# EAGLE design main_pa6 (EAGLE 4.11)
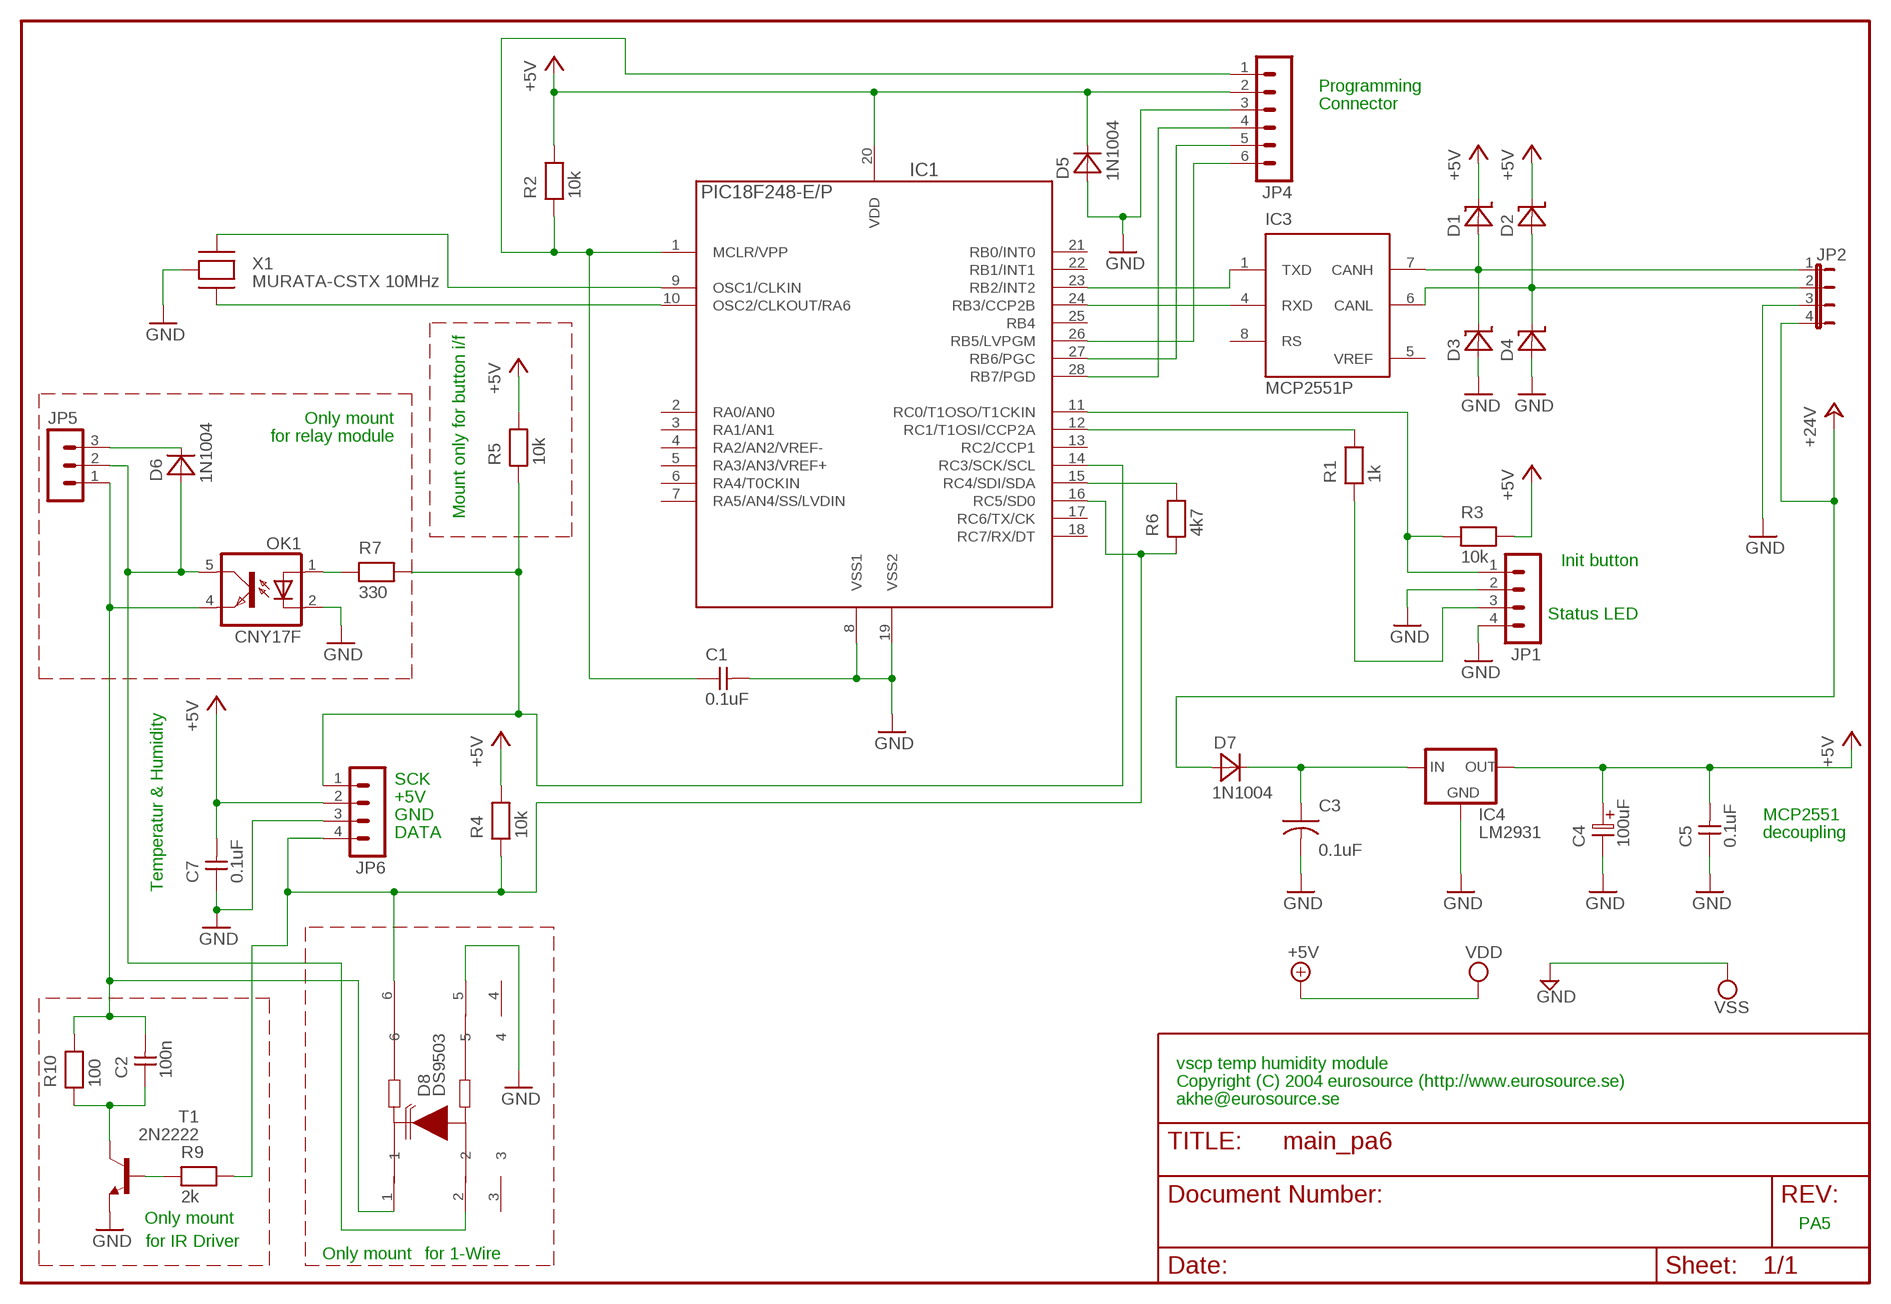
[diagram p0: schematic, sheet 1]

## Parts
C1  0.1uF  CAPNP-2,5  [C-2,5]
C2  100n  CAPNP-2,5  [C-2,5]
C3  0.1uF  CAP-5  [C-5]
C4  100uF  ELC-5  [ES-5]
C5  0.1uF  CAPNP-2,5  [C-2,5]
C7  0.1uF  CAPNP-2,5  [C-2,5]
D1  ZDIO-2,5  [D-2,5]
D2  ZDIO-2,5  [D-2,5]
D3  ZDIO-2,5  [D-2,5]
D4  ZDIO-2,5  [D-2,5]
D5  1N1004  DIODE-7,5  [D-7,5]
D6  1N1004  DIODE-7,5  [D-7,5]
D7  1N1004  DIODE-7,5  [D-7,5]
D8  DS9503  [TSOC6]
IC1  PIC18F248-E/P  PIC18F252-E/P  [PDIP-28]
IC3  MCP2551P  [DIL8]
IC4  LM2931  78LXX  [78LXX]
JP1  MA04-1  [MA04-1]
JP2  JP4E  [JP4]
JP4  MA06-1  [MA06-1]
JP5  MA03-1  [MA03-1]
JP6  MA04-1  [MA04-1]
OK1  CNY17F  [DIL06]
R1  1k  RESEU-5  [R-5]
R2  10k  RESEU-5  [R-5]
R3  10k  RESEU-5  [R-5]
R4  10k  RESEU-5  [R-5]
R5  10k  RESEU-5  [R-5]
R6  4k7  RESEU-5  [R-5]
R7  330  RESEU-5  [R-5]
R9  2k  RESEU-5  [R-5]
R10  100  RESEU-5  [R-5]
T1  2N2222  [TO18]
X1  MURATA-CSTX 10MHz  MURATA-CSTX  [RESONATOR-MURATA]

## Nets
+5V: D5.2(K) IC1.20(VDD) JP4.2 R2.2
+24V: D7.1(A) JP2.4
CANH: D1.1(A) D3.2(K) IC3.7(CANH) JP2.1
CANL: D2.1(A) D4.2(K) IC3.6(CANL) JP2.2
GND: C1.2 C3.2 C4.2 C5.1 C7.1 D3.1(A) D4.1(A) D5.1(A) D8.5 IC1.8(VSS1) IC1.9(OSC1/CLKIN) IC1.19(VSS2) IC4.GND JP1.2 JP1.4 JP2.3 JP4.3 JP6.3 OK1.2(C) T1.1(E) X1.1(XTIN) X1.2(GND) ; supply symbol labelled VSS
MCLR: C1.1 IC1.1(MCLR/VPP) JP4.1 R2.1
N$1: IC1.10(OSC2/CLKOUT/RA6) X1.3(XTOUT)
N$2: IC1.12(RC1/T1OSI/CCP2A) R1.2
N$5: JP1.3 R1.1
N$6: IC1.11(RC0/T1OSO/T1CKIN) JP1.1 R3.1
N$8: OK1.1(A) R7.1
N$9: D6.2(K) JP5.3
N$12: R9.1 T1.2(B)
N$13: C2.1 R10.1 T1.3(C)
N$22: C3.1 D7.2(K) IC4.IN
OWDATA: C2.2 D8.1 JP5.1 OK1.4(EMIT) R10.2
OWGND: D6.1(A) D8.2 JP5.2 OK1.5(COL)
PGC: IC1.27(RB6/PGC) JP4.5
PGD: IC1.28(RB7/PGD) JP4.4
PGM: IC1.26(RB5/LVPGM) JP4.6
RXCAN: IC1.24(RB3/CCP2B) IC3.4(RXD)
SCK: IC1.14(RC3/SCK/SCL) JP6.1 R5.1 R7.2
SDA: IC1.15(RC4/SDI/SDA) R6.2
SDO: D8.6 IC1.16(RC5/SD0) JP6.4 R4.1 R6.1 R9.2
TXCAN: IC1.23(RB2/INT2) IC3.1(TXD)
VDD: C4.1 C5.2 C7.2 D1.2(K) D2.2(K) IC4.OUT JP6.2 R3.2 R4.2 R5.2 ; supply symbol labelled +5V
Unconnected: D8.3 D8.4 IC1.2(RA0/AN0) IC1.3(RA1/AN1) IC1.4(RA2/AN2/VREF-) IC1.5(RA3/AN3/VREF+) IC1.6(RA4/T0CKIN) IC1.7(RA5/AN4/SS/LVDIN) IC1.13(RC2/CCP1) IC1.17(RC6/TX/CK) IC1.18(RC7/RX/DT) IC1.21(RB0/INT0) IC1.22(RB1/INT1) IC1.25(RB4) IC3.8(RS)

## Notes on the sheet
- Programming
- Connector
- Only mount
- for relay module
- Mount only for button i/f
- Init button
- Status LED
- SCK
- +5V
- GND | MCP2551
- DATA | decoupling
- Temperatur & Humidity
- vscp temp humidity module
- Copyright (C) 2004 eurosource (http://www.eurosource.se)
- akhe@eurosource.se
- Only mount
- PA5
- for IR Driver | Only mount | for 1-Wire

## Power pins joined to a net without a drawn wire
GND: IC3.2(VSS)
VDD: IC3.3(VDD)
VREF: IC3.5(VREF)

## Library data of the parts
C1 C2 C5 C7 = discrete:CAPNP-2,5
C3 = discrete:CAP-5
C4 = discrete:ELC-5
D1-D4 = discrete:ZDIO-2,5
D5-D7 = discrete:DIODE-7,5
D8 = eurosource_dallas:DS9503
IC1 = pic18:PIC18*F252-?: 18F252, 28 pin, 32Kb prog, 1536 data, 256 EEPROM
IC3 = microchip_can:MCP2551: High Speed CAN tranceiver
IC4 = v-reg:78LXX: VOLTAGE REGULATOR
JP1 JP6 = con-lstb:MA04-1
JP2 = jumper:JP4E: JUMPER
JP4 = con-lstb:MA06-1
JP5 = con-lstb:MA03-1
OK1 = optocoupler:CNY17F: SIEMENS OPTO COUPLER
R1-R7 R9 R10 = discrete:RESEU-5
T1 = transistor:2N2222: NPN TRANSISTOR
X1 = eurosource_ftdi:MURATA-CSTX

## Board
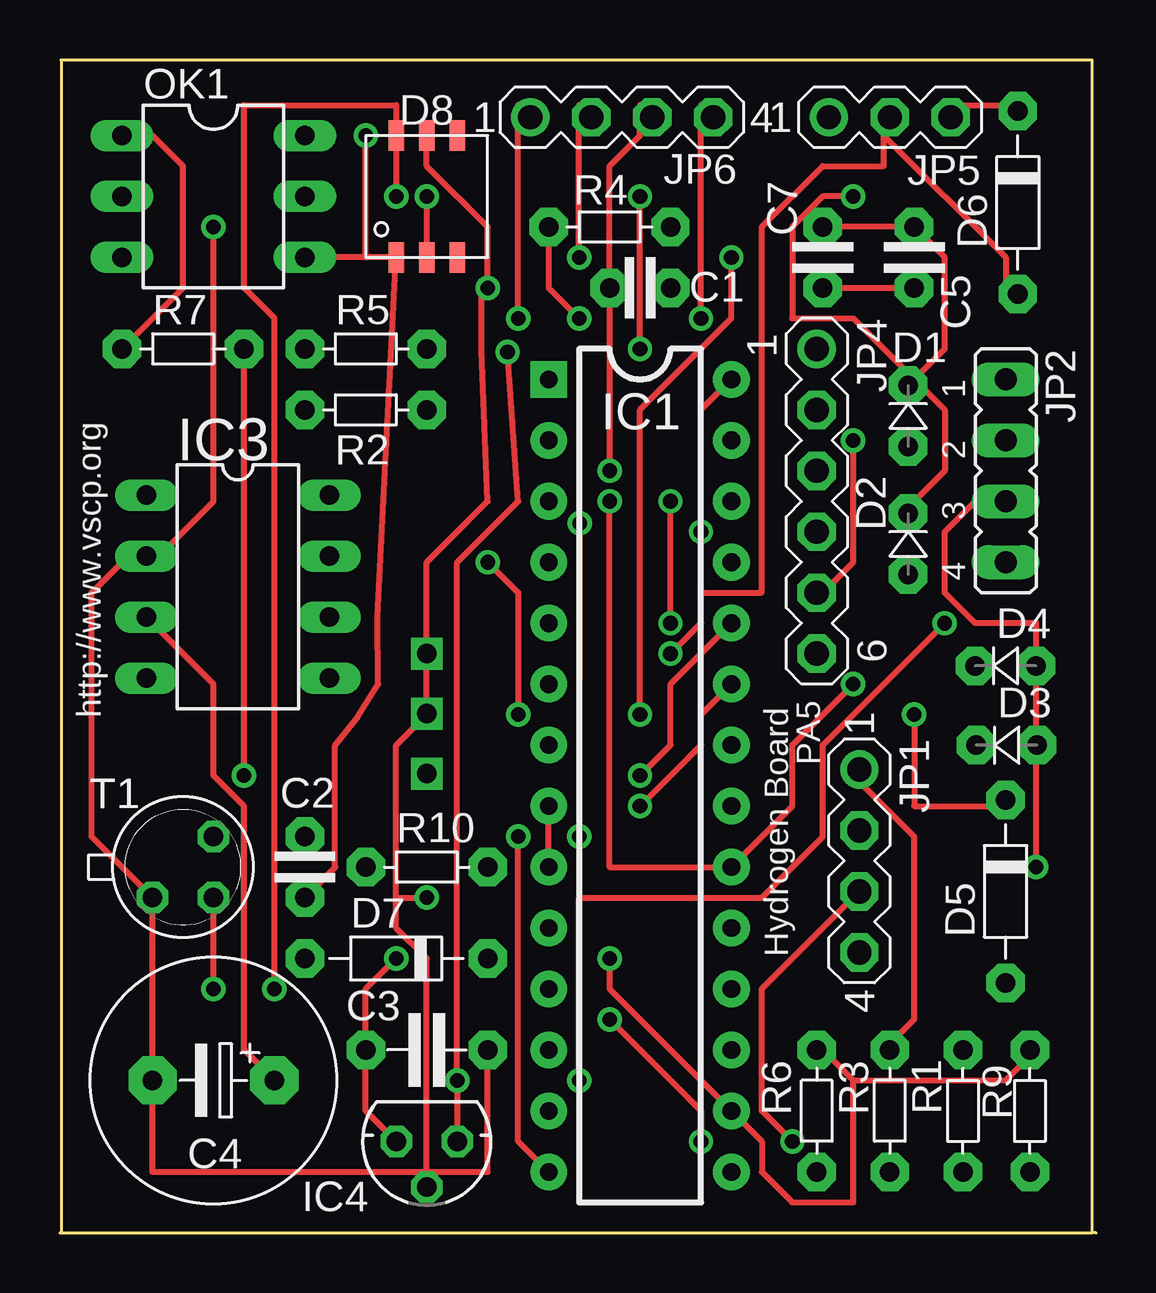
[diagram p1: board, top side]
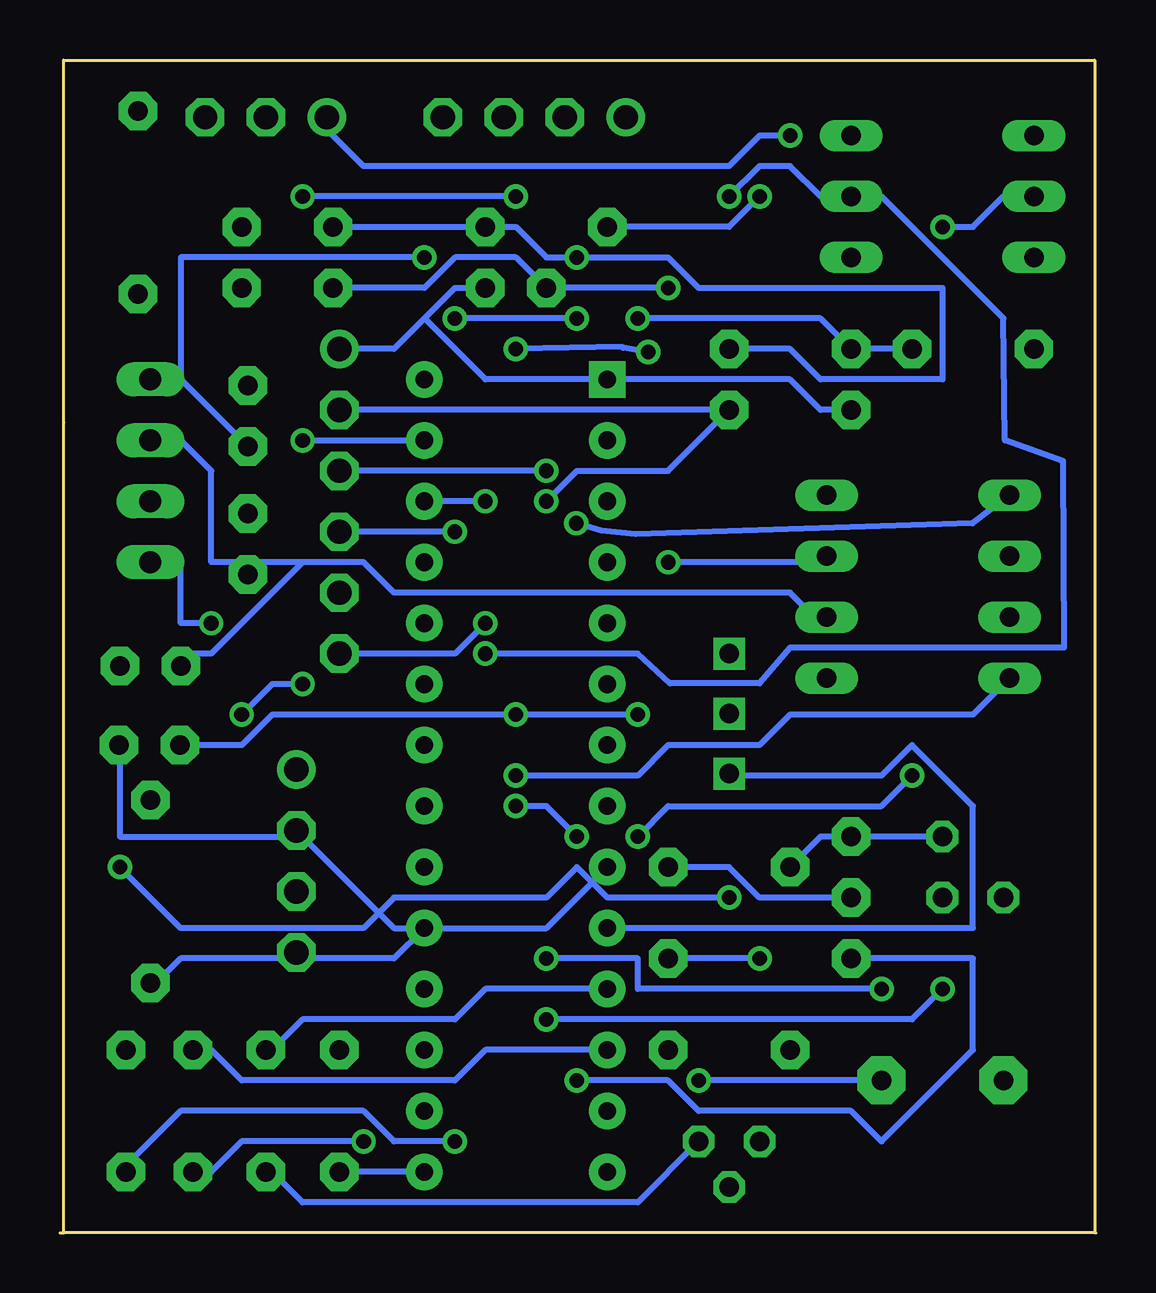
[diagram p2: board, bottom side, seen from below]

Size 43.18 x 48.87 mm. Coordinates in mm from the lower left corner, seen from the top.
Copper layers (1*16): Top 0.0254mm / dielectric 1.4986mm / Bottom 0.0254mm
Design rules "10mils": minimum track width 10mil, minimum drill 24mil, track to track 10mil, track to pad 10mil, pad to pad 10mil, via to via 10mil, smd to smd 10mil, copper to edge 40mil, drill to drill 10mil, minimum pad ring 10mil, minimum via ring 8mil, stop-mask expansion 0mil, vias tented up to drill 0mil, thermal gap 10mil

### Footprints (pad centres in the part's own frame; a part is rotated, then mirrored left to right if it is on the bottom)
C-2,5 = drill 0.813 pad 1.6 octagon: 1 -1.27,0; 2 1.27,0
C-5 = drill 0.813 pad 1.6 octagon: 1 -2.54,0; 2 2.54,0
ES-5 = drill 0.813 pad 2.007 octagon: 1 -2.54,0; 2 2.54,0
D-2,5 = drill 0.813 pad 1.6 octagon: 1 -1.27,0; 2 1.27,0
D-7,5 = drill 0.813 pad 1.6 octagon: 1 -3.81,0; 2 3.81,0
TSOC6 = smd 1.27 x 0.635: 1 -2.54,1.27; 2 -2.54,0; 3 -2.54,-1.27; 4 2.54,-1.27; 5 2.54,0; 6 2.54,1.27
PDIP-28 = drill 0.737 pad 1.524 square: 1 -17.78,-3.81 | drill 0.737 pad 1.524 round: 2 -15.24,-3.81; 3 -12.7,-3.81; 4 -10.16,-3.81; 5 -7.62,-3.81; 6 -5.08,-3.81; 7 -2.54,-3.81; 8 0,-3.81; 9 2.54,-3.81; 10 5.08,-3.81; 11 7.62,-3.81; 12 10.16,-3.81; 13 12.7,-3.81; 14 15.24,-3.81; 15 15.24,3.81; 16 12.7,3.81; 17 10.16,3.81; 18 7.62,3.81; 19 5.08,3.81; 20 2.54,3.81; 21 0,3.81; 22 -2.54,3.81; 23 -5.08,3.81; 24 -7.62,3.81; 25 -10.16,3.81; 26 -12.7,3.81; 27 -15.24,3.81; 28 -17.78,3.81
DIL8 = drill 0.813 long: 1 -3.81,-3.81; 2 -1.27,-3.81; 3 1.27,-3.81; 4 3.81,-3.81; 5 3.81,3.81; 6 1.27,3.81; 7 -1.27,3.81; 8 -3.81,3.81
78LXX = drill 0.813 octagon: GND 0,1.905; IN 1.27,0; OUT -1.27,0
MA04-1 = drill 1.016 pad 1.6 round: 1 -3.81,0 | drill 1.016 pad 1.6 octagon: 2 -1.27,0; 3 1.27,0; 4 3.81,0
JP4 = drill 0.914 long: 1 -3.81,0; 2 -1.27,0; 3 1.27,0; 4 3.81,0
MA06-1 = drill 1.016 pad 1.6 round: 1 -6.35,0 | drill 1.016 pad 1.6 octagon: 2 -3.81,0; 3 -1.27,0; 4 1.27,0; 5 3.81,0; 6 6.35,0
MA03-1 = drill 1.016 pad 1.6 round: 1 -2.54,0 | drill 1.016 pad 1.6 octagon: 2 0,0; 3 2.54,0
DIL06 = drill 0.813 long: 1 -2.54,-3.81; 2 0,-3.81; 3 2.54,-3.81; 4 2.54,3.81; 5 0,3.81; 6 -2.54,3.81
R-5 = drill 0.813 pad 1.6 octagon: 1 -2.54,0; 2 2.54,0
TO18 = drill 0.813 octagon: 1 -1.27,-1.27; 2 1.27,-1.27; 3 1.27,1.27
RESONATOR-MURATA = drill 0.813 square: 1 0,0; 2 2.5,0; 3 5,0

### Placement (x,y rotation side)
C1  24.18,39.37 180 top
C2  10.21,15.24 270 top
C3  15.29,7.62 0 top
C4  6.4,6.35 180 top
C5  35.61,40.64 90 top
C7  31.8,40.64 90 top
D1  35.35,34.04 90 top
D2  35.35,28.7 90 top
D3  39.46,20.32 180 top
D4  39.42,23.62 180 top
D5  39.42,14.22 90 top
D6  39.93,42.93 90 top
D7  14.02,11.43 0 top
D8  15.29,43.18 90 top
IC1  24.18,17.78 270 top
IC3  7.42,26.92 270 top
IC4  15.29,3.81 180 top
JP1  33.32,15.49 270 top
JP2  39.42,31.75 270 top
JP4  31.54,30.48 270 top
JP5  34.59,46.48 0 top
JP6  23.42,46.48 0 top
OK1  6.4,43.18 270 top
R1  37.64,5.08 90 top
R2  12.75,34.29 0 top
R3  34.59,5.08 270 top
R4  22.91,41.91 0 top
R5  12.75,36.83 0 top
R6  31.54,5.08 270 top
R7  5.13,36.83 0 top
R9  40.44,5.08 90 top
R10  15.29,15.24 0 top
T1  5.13,15.24 0 top
U$2  [DIN_SIMPLE]  0.05,0 0 top
X1  15.29,24.13 270 top

### Tracks (layer width: path | path; a pad name or v marks a point on that pad's centre or on a via)
+5V  (via drill 0.61)
  Top 0.254: v22.91,30.48 22.91,15.24 IC1.20 30.53,17.78 30.53,20.32 v33.07,22.86 | v35.61,21.59 35.61,17.78 39.42,17.78 D5.2
  Bottom 0.254: v22.91,30.48 21.64,31.75 17.83,31.75 R2.2 JP4.2 31.8,34.29 | v35.61,21.59 34.34,22.86 v33.07,22.86
+24V  (via drill 0.61)
  Top 0.254: v36.88,25.4 31.8,20.32 31.8,16.51 29.26,13.97 21.64,13.97 v21.64,6.35
  Bottom 0.254: v36.88,25.4 38.15,25.4 38.15,27.94 JP2.4 | v21.64,6.35 17.83,6.35 16.56,5.08 10.21,5.08 8.94,3.81 5.13,7.62 5.13,11.43 D7.1
CANH  (via drill 0.61)
  Top 0.254: v17.83,27.94 19.1,26.67 v19.1,21.59 | v27.99,40.64 27.99,38.1 24.18,34.29 v24.18,21.59
  Bottom 0.254: 38.15,35.56 D1.1 | v17.83,27.94 11.48,27.94 IC3.7 | v19.1,21.59 v24.18,21.59 34.34,21.59 35.61,20.32 D3.2 | 38.15,35.56 38.15,40.64 v27.99,40.64 | 38.15,35.56 JP2.1
CANL
  Bottom 0.254: 33.07,27.94 35.61,27.94 | 33.07,27.94 30.53,27.94 29.26,26.67 12.75,26.67 11.48,25.4 IC3.6 | 35.61,27.94 36.88,27.94 36.88,31.75 38.15,33.02 JP2.2 | 35.61,27.94 D2.1 | 33.07,27.94 36.88,24.13 38.15,24.13 D4.2
GND  (via drill 0.61)
  Top 0.254: 40.69,24.13 40.69,25.4 38.15,25.4 36.88,26.67 36.88,29.21 38.15,30.48 JP2.3 | 40.69,20.32 40.69,24.13 | 40.69,24.13 D4.1 | IC1.9 IC1.8 | C7.1 C5.1 | JP6.3 24.18,46.99 24.18,45.72 22.91,44.45 C1.2 v22.91,31.75 | D8.5 15.29,44.45 17.83,41.91 v17.83,39.37 17.57,39.37 17.57,36.76 17.83,30.48 15.29,27.94 X1.1 X1.2 15.29,21.59 14.02,20.32 14.02,13.97 | 15.29,2.54 17.83,2.54 C3.2 | v6.4,41.91 6.4,30.48 3.86,27.94 IC3.2 2.59,27.94 1.32,26.67 1.32,16.51 T1.1 C4.2 3.86,2.54 15.29,2.54 | 14.02,13.97 14.02,12.7 15.29,11.43 15.29,2.54 | 15.29,2.54 IC4.GND | v40.69,15.24 40.69,20.32 | 14.02,13.97 v15.29,13.97 | 40.69,20.32 D3.1
  Bottom 0.254: IC1.19 29.26,11.43 33.07,11.43 | 33.07,11.43 38.15,11.43 39.42,10.16 D5.1 | 33.07,11.43 JP1.4 | 33.07,16.51 29.26,12.7 IC1.19 | IC1.9 22.91,12.7 IC1.19 | 33.07,16.51 40.69,16.51 40.69,20.32 D3.1 | 33.07,16.51 JP1.2 | v22.91,31.75 JP4.3 31.8,31.75 | C7.1 27.99,39.37 26.72,40.64 24.18,40.64 C1.2 v17.83,39.37 | v6.4,41.91 5.13,41.91 3.86,43.18 OK1.2 | v40.69,15.24 38.15,12.7 30.53,12.7 29.26,13.97 22.91,13.97 21.64,15.24 20.37,13.97 v15.29,13.97
MCLR
  Bottom 0.254: C1.1 26.72,39.37 27.99,38.1 | 27.99,38.1 29.26,36.83 JP4.1 31.8,36.83 | R2.1 11.48,34.29 12.75,35.56 IC1.1 25.45,35.56 27.99,38.1
N$1
  Bottom 0.254: IC1.10 5.13,12.7 5.13,17.78 7.67,20.32 8.94,19.05 15.29,19.05 X1.3
N$2
  Bottom 0.254: IC1.12 25.45,7.62 26.72,6.35 35.61,6.35 36.88,7.62 R1.2
N$5  (via drill 0.61)
  Top 0.254: v30.53,3.81 29.26,5.08 29.26,10.16 JP1.3
  Bottom 0.254: v30.53,3.81 35.61,3.81 36.88,2.54 R1.1
N$6
  Top 0.254: JP1.1 33.07,19.05 35.61,16.51 35.61,8.89 34.34,7.62 R3.1
  Bottom 0.254: IC1.11 25.45,10.16 26.72,8.89 33.07,8.89 34.34,7.62 R3.1
N$8
  Top 0.254: R7.1 5.13,39.37 5.13,44.45 3.86,45.72 OK1.1
N$9
  Top 0.254: JP5.3 36.88,46.99 39.42,46.99 D6.2
N$12  (via drill 0.61)
  Top 0.254: v6.4,10.16 T1.2 | v22.91,8.89 26.72,5.08 v26.72,3.81
  Bottom 0.254: v6.4,10.16 7.67,8.89 v22.91,8.89 | v26.72,3.81 29.26,3.81 30.53,5.08 38.15,5.08 40.69,2.54 R9.1
N$13
  Bottom 0.254: T1.3 C2.1 11.48,16.51 R10.1
N$22  (via drill 0.61)
  Top 0.254: IC4.IN 12.75,5.08 C3.1 12.75,10.16 v14.02,11.43
  Bottom 0.254: v14.02,11.43 D7.2
OWDATA  (via drill 0.61)
  Top 0.254: 12.75,40.64 D8.1 13.23,25.69 13.27,22.86 12.39,21.46 11.48,20.32 11.48,15.24 C2.2 | 12.75,40.64 OK1.4 | 12.75,40.64 v12.75,45.72
  Bottom 0.254: C2.2 14.02,13.97 15.29,15.24 R10.2 | v12.75,45.72 14.02,45.72 15.29,44.45 30.53,44.45 31.8,45.72 JP5.1
OWGND  (via drill 0.61)
  Top 0.254: v15.29,43.18 D8.2 | 34.34,45.72 39.42,40.64 39.42,39.37 D6.1 | v25.45,24.13 26.72,25.4 26.72,26.67 29.26,26.67 29.26,41.91 31.8,44.45 34.34,44.45 34.34,45.72 | 34.34,45.72 JP5.2
  Bottom 0.254: v15.29,43.18 14.02,44.45 12.75,44.45 11.48,43.18 OK1.5 8.94,43.18 3.86,38.1 3.79,33.01 1.36,32.15 1.32,24.39 12.75,24.39 14.02,22.9 17.75,22.9 19.1,24.13 v25.45,24.13
PGC  (via drill 0.61)
  Top 0.254: v33.07,33.02 33.07,27.94 31.8,26.67 JP4.5
  Bottom 0.254: v33.07,33.02 IC1.27
PGD  (via drill 0.61)
  Top 0.254: IC1.28 26.72,34.29 v26.72,29.21
  Bottom 0.254: v26.72,29.21 JP4.4 31.8,29.21
PGM  (via drill 0.61)
  Top 0.254: v25.45,25.4 v25.45,30.48
  Bottom 0.254: v25.45,30.48 IC1.26 | v25.45,25.4 26.72,24.13 JP4.6 31.8,24.13
RXCAN  (via drill 0.61)
  Top 0.254: v24.18,19.05 25.45,20.32 25.45,22.86 IC1.24
  Bottom 0.254: v24.18,19.05 19.1,19.05 17.83,20.32 14.02,20.32 12.75,21.59 5.13,21.59 IC3.4
SCK  (via drill 0.61)
  Top 0.254: IC1.14 19.1,3.81 v19.1,16.51 | v7.67,19.05 R7.2 | v19.1,38.1 19.1,46.99 JP6.1
  Bottom 0.254: v19.1,16.51 17.83,17.78 8.94,17.78 v7.67,19.05 | R7.2 R5.1 11.48,38.1 v19.1,38.1
SDA
  Bottom 0.254: IC1.15 R6.2 31.8,2.54
SDO  (via drill 0.61)
  Top 0.254: 33.07,6.35 33.07,1.27 30.53,1.27 29.26,2.54 29.26,3.81 IC1.16 22.91,10.16 v22.91,11.43 | 33.07,6.35 31.8,7.62 R6.1 | 33.07,6.35 39.42,6.35 40.69,7.62 R9.2 | v14.02,43.18 D8.6 14.02,46.99 7.67,46.99 7.67,39.37 8.94,38.1 v8.94,10.16 | v26.72,38.1 26.72,46.99 JP6.4 | v21.64,38.1 20.37,39.37 R4.1
  Bottom 0.254: v14.02,43.18 15.29,41.91 R4.1 | v21.64,38.1 v26.72,38.1 | v22.91,11.43 19.1,11.43 19.1,10.16 v8.94,10.16
TXCAN  (via drill 0.61)
  Top 0.254: v21.66,29.57 v21.64,16.51 | v24.18,17.78 26.72,20.32 26.72,21.59 IC1.23
  Bottom 0.254: v21.66,29.57 20.61,29.25 19.19,29.11 5.15,29.57 IC3.1 | v21.64,16.51 22.91,17.78 v24.18,17.78
VDD  (via drill 0.61)
  Top 0.254: 35.61,35.56 36.88,34.29 36.88,31.75 35.61,30.48 D2.2 | C7.2 C5.2 36.88,40.64 36.88,36.83 35.61,35.56 | v21.64,40.64 21.64,46.99 JP6.2 | C4.1 7.67,7.62 7.67,17.78 6.4,19.05 6.4,22.86 IC3.3 | IC4.OUT v16.56,6.35 16.56,27.94 19.1,30.48 v18.66,36.7 | 35.61,35.56 33.07,38.1 30.53,38.1 30.53,41.91 31.8,43.18 v33.07,43.18 | v24.18,36.83 v24.18,43.18 | 35.61,35.56 D1.2
  Bottom 0.254: R5.2 12.75,36.83 11.48,35.56 6.4,35.56 6.4,39.37 16.56,39.37 17.83,40.64 v21.64,40.64 22.91,40.64 24.18,41.91 R4.2 C7.2 | IC4.OUT 19.1,1.27 33.07,1.27 34.34,2.54 R3.2 | C4.1 v16.56,6.35 | v24.18,43.18 v33.07,43.18 | v18.66,36.7 19.7,36.87 19.74,36.91 v24.18,36.83

### Text on the board
tNames: http://www.vscp.org | PA5 | Hydrogen Board
tValues: eurosource